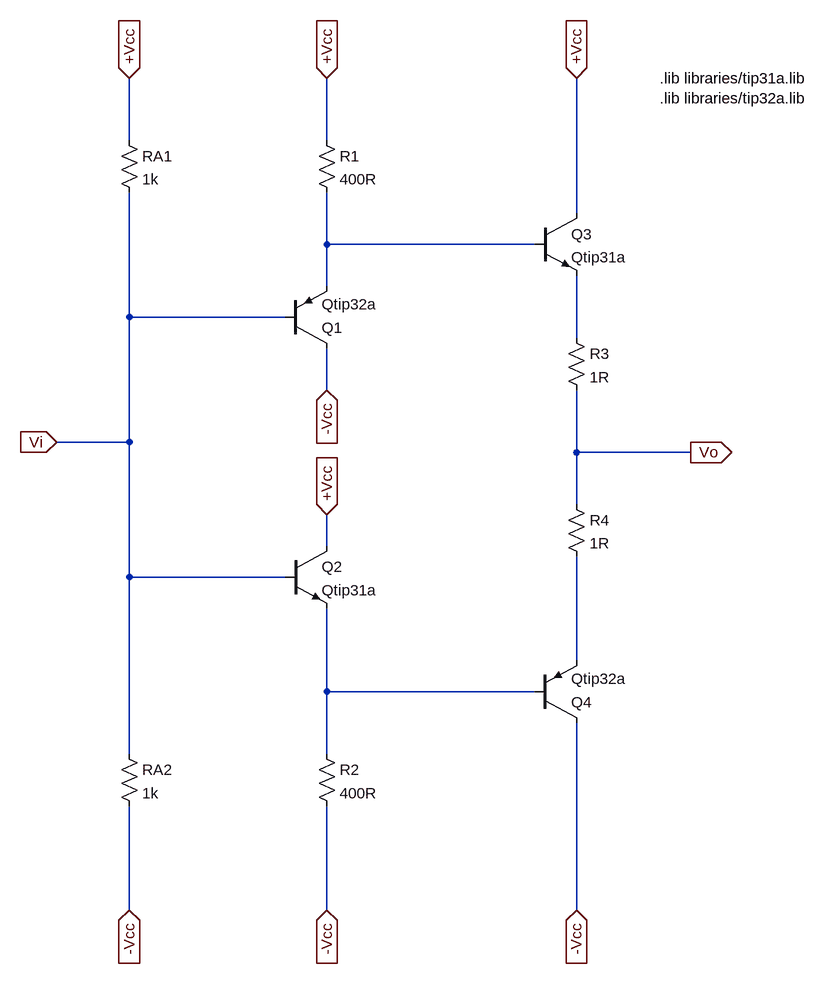
[diagram p0: schematic ab-power-amp.asc]
ab-power-amp.asc, the LTspice schematic file:
Version 4
SHEET 1 880 680
WIRE -560 -1936 -560 -2032
WIRE -256 -1936 -256 -2032
WIRE 128 -1824 128 -2032
WIRE -256 -1776 -256 -1856
WIRE 64 -1776 -256 -1776
WIRE -256 -1712 -256 -1776
WIRE -560 -1664 -560 -1856
WIRE -320 -1664 -560 -1664
WIRE 128 -1632 128 -1728
WIRE -256 -1552 -256 -1616
WIRE -560 -1472 -560 -1664
WIRE -560 -1472 -672 -1472
WIRE 128 -1456 128 -1552
WIRE 304 -1456 128 -1456
WIRE 128 -1376 128 -1456
WIRE -256 -1312 -256 -1360
WIRE -560 -1264 -560 -1472
WIRE -320 -1264 -560 -1264
WIRE 128 -1136 128 -1296
WIRE -256 -1088 -256 -1216
WIRE 64 -1088 -256 -1088
WIRE -560 -992 -560 -1264
WIRE -256 -992 -256 -1088
WIRE -560 -752 -560 -912
WIRE -256 -752 -256 -912
WIRE 128 -752 128 -1040
FLAG -560 -2032 +Vcc
IOPIN -560 -2032 In
FLAG -560 -752 -Vcc
IOPIN -560 -752 In
FLAG 304 -1456 Vo
IOPIN 304 -1456 Out
FLAG -256 -2032 +Vcc
IOPIN -256 -2032 In
FLAG 128 -2032 +Vcc
IOPIN 128 -2032 In
FLAG -256 -1360 +Vcc
IOPIN -256 -1360 In
FLAG -256 -752 -Vcc
IOPIN -256 -752 In
FLAG 128 -752 -Vcc
IOPIN 128 -752 In
FLAG -256 -1552 -Vcc
IOPIN -256 -1552 In
FLAG -672 -1472 Vi
IOPIN -672 -1472 In
SYMBOL npn -320 -1312 R0
SYMATTR InstName Q2
SYMATTR Value Qtip31a
SYMBOL pnp 64 -1040 M180
SYMATTR InstName Q4
SYMATTR Value Qtip32a
SYMBOL npn 64 -1824 R0
SYMATTR InstName Q3
SYMATTR Value Qtip31a
SYMBOL pnp -320 -1616 M180
SYMATTR InstName Q1
SYMATTR Value Qtip32a
SYMBOL res -576 -1952 R0
SYMATTR InstName RA1
SYMATTR Value 1k
SYMBOL res -576 -1008 R0
SYMATTR InstName RA2
SYMATTR Value 1k
SYMBOL res -272 -1952 R0
SYMATTR InstName R1
SYMATTR Value 400R
SYMBOL res -272 -1008 R0
SYMATTR InstName R2
SYMATTR Value 400R
SYMBOL res 112 -1648 R0
SYMATTR InstName R3
SYMATTR Value 1R
SYMBOL res 112 -1392 R0
SYMATTR InstName R4
SYMATTR Value 1R
TEXT 256 -2032 Left 2 !.lib libraries/tip31a.lib\n.lib libraries/tip32a.lib

The netlist it stands for:
* ab-power-amp.asc
Q2 +Vcc Vi N004 0 Qtip31a
Q4 -Vcc N004 N003 0 Qtip32a
Q3 +Vcc N001 N002 0 Qtip31a
Q1 -Vcc Vi N001 0 Qtip32a
RA1 +Vcc Vi 1k
RA2 Vi -Vcc 1k
R1 +Vcc N001 400R
R2 N004 -Vcc 400R
R3 N002 Vo 1R
R4 Vo N003 1R
.model NPN NPN
.model PNP PNP
.lib standard.bjt
.lib libraries/tip31a.lib
.lib libraries/tip32a.lib
.backanno
.end